# EAGLE design Sunsensors_v1.0 (EAGLE 7.1.0)
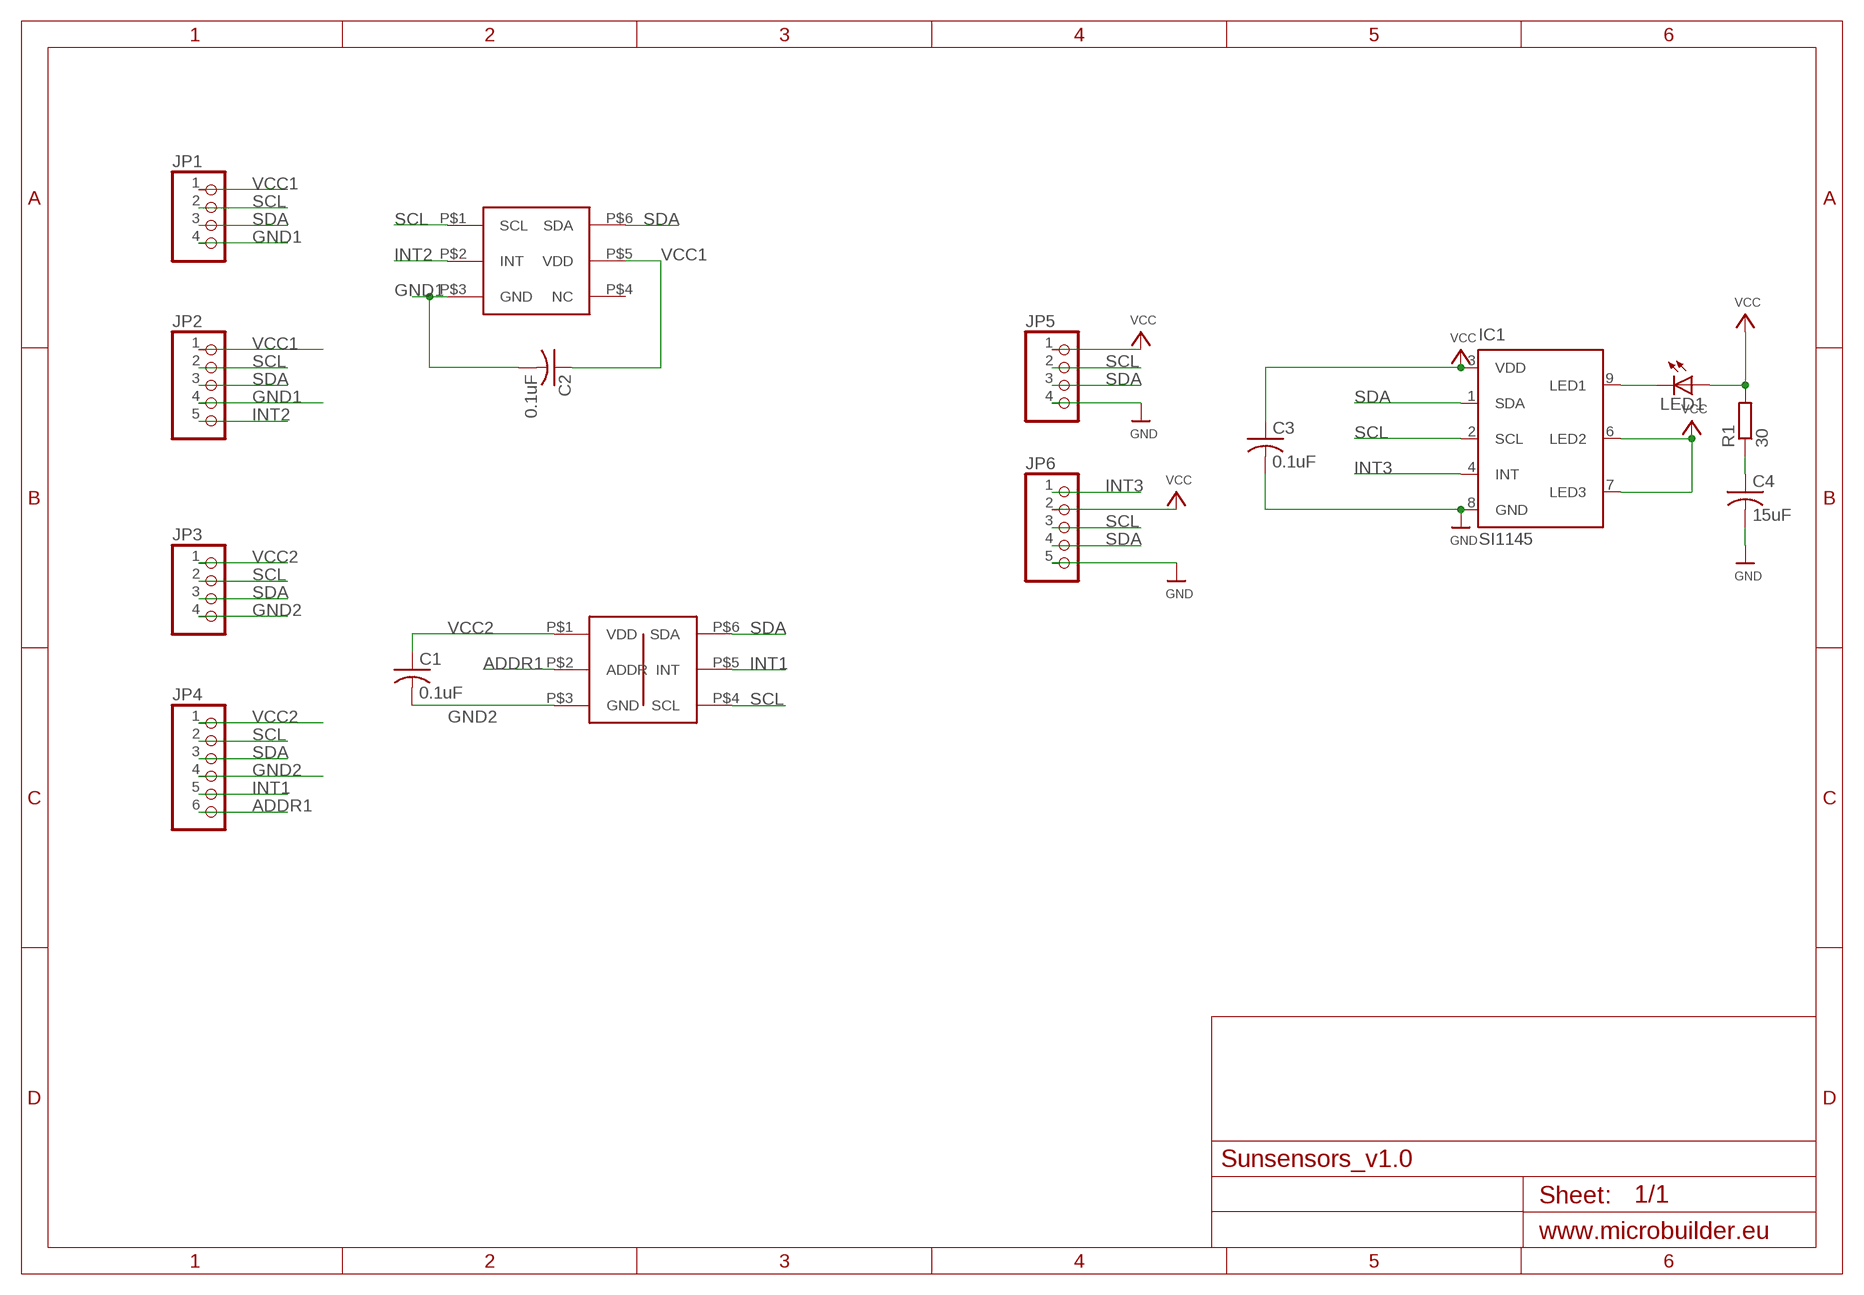
[diagram p0: schematic, sheet 1]

## Parts
C1  0.1uF  C-USC0805  [C0805]
C2  0.1uF  C-USC0805  [C0805]
C3  0.1uF  C-USC0805  [C0805]
C4  15uF  C-USC0805  [C0805]
IC1  SI1145  [QFN-10]
JP1  PINHD-1X4  [1X04]
JP2  PINHD-1X5  [1X05]
JP3  PINHD-1X4  [1X04]
JP4  PINHD-1X6  [1X06]
JP5  PINHD-1X4  [1X04]
JP6  PINHD-1X5  [1X05]
LED1  LEDCHIPLED_0805  [CHIPLED_0805]
R1  30  R-EU_R1206  [R1206]
U$8  TSL25911FN  [ODFN6]
U$9  TSL2561T  [TMB-6]

## Nets
ADDR1: JP4.6 U$9.P$2(ADDR)
GND: C3.2 C4.2 IC1.8(GND) JP5.4 JP6.5
GND1: C2.2 JP1.4 JP2.4 U$8.P$3(GND)
GND2: C1.2 JP3.4 JP4.4 U$9.P$3(GND)
INT1: JP4.5 U$9.P$5(INT)
INT2: JP2.5 U$8.P$2(INT)
INT3: IC1.4(INT) JP6.1
N$1: C4.1 R1.1
N$3: IC1.9(LED1) LED1.C
SCL: IC1.2(SCL) JP1.2 JP2.2 JP3.2 JP4.2 JP5.2 JP6.3 U$8.P$1(SCL) U$9.P$4(SCL)
SDA: IC1.1(SDA) JP1.3 JP2.3 JP3.3 JP4.3 JP5.3 JP6.4 U$8.P$6(SDA) U$9.P$6(SDA)
VCC: C3.1 IC1.3(VDD) IC1.6(LED2) IC1.7(LED3) JP5.1 JP6.2 LED1.A R1.2
VCC1: C2.1 JP1.1 JP2.1 U$8.P$5(VDD)
VCC2: C1.1 JP3.1 JP4.1 U$9.P$1(VDD)
Unconnected: U$8.P$4(NC)

## Library data of the parts
C1-C4 = adafruit:C-US: CAPACITOR, American symbol
IC1 = silabs:SI114*: PROXIMITY/UV/AMBIENT LIGHT SENSOR IC WITH I2C INTERFACE Source: http://www.silabs.com/Support%20Documents/TechnicalDocs/Si1145-46-47.pdf
JP1 JP3 JP5 = pinhead:PINHD-1X4: PIN HEADER
JP2 JP6 = pinhead:PINHD-1X5: PIN HEADER
JP4 = pinhead:PINHD-1X6: PIN HEADER
LED1 = adafruit:LED: LED OSRAM: - CHIPLED LG R971, LG N971, LY N971, LG Q971, LY Q971, LO R971, LY R971 LH N974, LH R974 LS Q976, LO Q976, LY Q976 LO Q996 - Hyper CHIPLED LW Q18S LB Q993, LB Q99A, LB R99A - SideLED LS A670, LO A670, LY A670, LG A670, LP A670 LB A673, LV A673, LT A673, LW A673 LH A674 LY A675 LS A676, LA A676, LO A676, LY A676, LW A676 LS A679, LY A679, LG A679 - Hyper Micro SIDELED® LS Y876, LA Y876, LO Y876, LY Y876 LT Y87S - SmartLED LW L88C, LW L88S LB L89C, LB L89S, LG L890 LS L89K, LO L89K, LY L89K LS L896, LA L896, LO L896, LY L896 - TOPLED LS T670, LO T670, LY T670, LG T670, LP T670 LSG T670, LSP T670, LSY T670, LOP T670, LYG T670 LG T671, LOG T671, LSG T671 LB T673, LV T673, LT T673, LW T673 LH T674 LS T676, LA T676, LO T676, LY T676, LB T676, LH T676, LSB T676, LW T676 LB T67C, LV T67C, LT T67C, LS T67K, LO T67K, LY T67K, LW E67C LS E67B, LA E67B, LO E67B, LY E67B, LB E67C, LV E67C, LT E67C LW T67C LS T679, LY T679, LG T679 LS T770, LO T770, LY T770, LG T770, LP T770 LB T773, LV T773, LT T773, LW T773 LH T774 LS E675, LA E675, LY E675, LS T675 LS T776, LA T776, LO T776, LY T776, LB T776 LHGB T686 LT T68C, LB T68C - Hyper Mini TOPLED® LB M676 - Mini TOPLED Santana® LG M470 LS M47K, LO M47K, LY M47K Source: http://www.osram.convergy.de/
R1 = rcl:R-EU_: RESISTOR, European symbol
U$8 = lpatiny:TSL25911FN: The TSL2591 is a very-high sensitivity light-to-digital converter that transforms light intensity into a digital signal output capable of direct I 2 C interface.
U$9 = lpatiny:TSL2561T: The TSL2560 and TSL2561 are light-to-digital converters that transform light intensity to a digital signal output capable of direct I 2 C (TSL2561) or SMBus (TSL2560) interface.

## Board
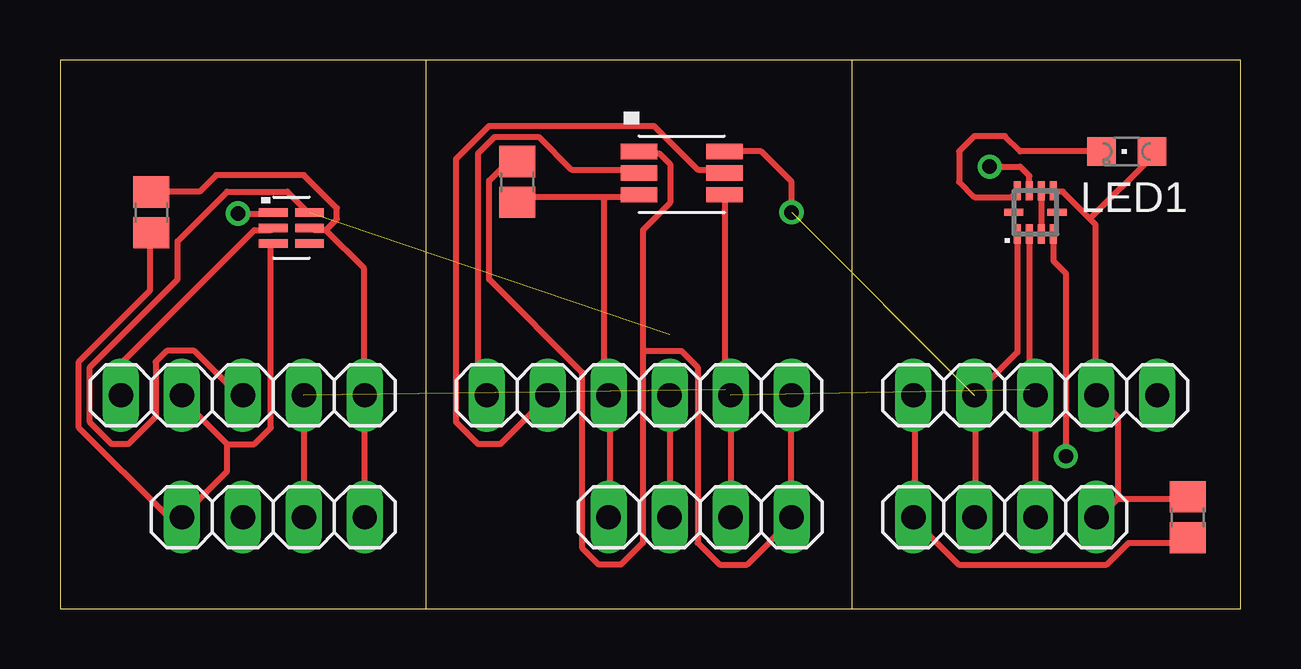
[diagram p1: board, top side]
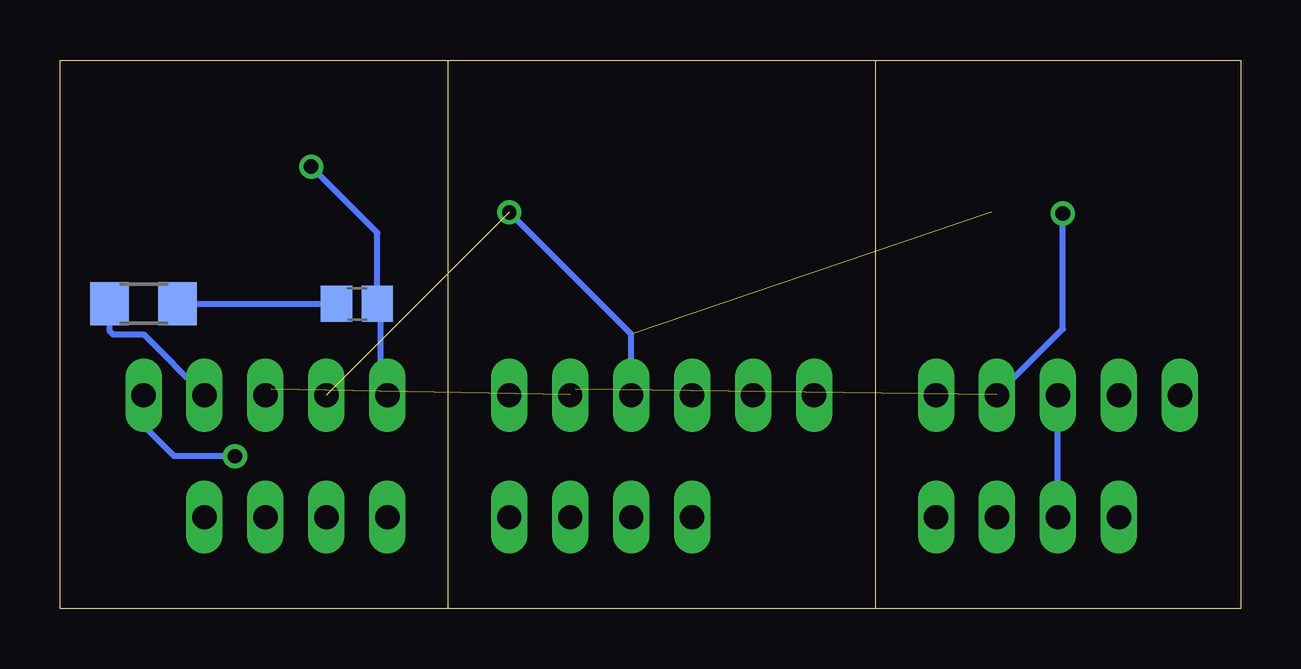
[diagram p2: board, bottom side, seen from below]

Size 49.2 x 22.86 mm. Coordinates in mm from the lower left corner, seen from the top.
Outline: 15.24,0 0,0 0,22.85 49.2,22.85 49.2,0 33.02,0
Outline: 15.24,0 33.02,0
Outline: 15.24,22.86 15.24,0
Outline: 33.02,0 33.02,22.86
Copper layers (1*16): Top 0.035mm / dielectric 1.5mm / Bottom 0.035mm
Design rules "default": minimum track width 10mil, minimum drill 24mil, track to track 8mil, track to pad 8mil, pad to pad 8mil, via to via 8mil, smd to smd 8mil, copper to edge 40mil, drill to drill 8mil, minimum pad ring 10mil, minimum via ring 8mil, stop-mask expansion 4mil, vias tented up to drill 0mil, thermal gap 10mil

### Footprints (pad centres in the part's own frame; a part is rotated, then mirrored left to right if it is on the bottom)
C0805 = smd 1.3 x 1.5: 1 -0.85,0; 2 0.85,0
QFN-10 = smd 0.8 x 0.3: 1 -0.9,0.75; 2 -0.9,0.25; 3 -0.9,-0.25; 4 -0.9,-0.75; 6 0.9,-0.75; 7 0.9,-0.25; 8 0.9,0.25; 9 0.9,0.75 | smd 0.3 x 0.8: 5 0,-0.9; 10 0,0.9
1X04 = drill 1.016 long: 1 -3.81,0; 2 -1.27,0; 3 1.27,0; 4 3.81,0
1X05 = drill 1.016 long: 1 -5.08,0; 2 -2.54,0; 3 0,0; 4 2.54,0; 5 5.08,0
1X06 = drill 1.016 long: 1 -6.35,0; 2 -3.81,0; 3 -1.27,0; 4 1.27,0; 5 3.81,0; 6 6.35,0
CHIPLED_0805 = smd 1.2 x 1.2: A 0,-1.05; C 0,1.05
R1206 = smd 1.6 x 1.803: 1 -1.422,0; 2 1.422,0
ODFN6 = smd 1.199 x 0.351: P$1 0,0; P$2 0,-0.65; P$3 0,-1.3; P$4 1.501,-1.3; P$5 1.501,-0.65; P$6 1.501,0
TMB-6 = smd 1.524 x 0.635: P$1 0,0; P$2 0,-0.899; P$3 0,-1.801; P$4 3.556,-1.801; P$5 3.556,-0.899; P$6 3.556,0

### Placement (x,y rotation side)
C1  19.05,17.78 270 top
C2  3.81,16.51 270 top
C3  46.99,3.81 270 top
C4  36.83,12.7 0 bottom
IC1  40.64,16.51 90 top
JP1  8.89,3.81 180 top
JP2  7.62,8.89 180 top
JP3  26.67,3.81 180 top
JP4  24.13,8.89 180 top
JP5  39.37,3.81 180 top
JP6  40.64,8.89 180 top
LED1  44.45,19.05 90 top
R1  45.72,12.7 180 bottom
U$8  8.89,16.51 0 top
U$9  24.13,19.05 0 top

### Tracks (layer width: path | path; a pad name or v marks a point on that pad's centre or on a via)
ADDR1
  Top 0.254: U$9.P$2 24.05,18.29 21.31,18.29 19.94,19.66 18.11,19.66 17.42,18.97 17.42,9.14 17.65,8.91 JP4.6
GND  (via drill 0.6)
  Top 0.254: C3.2 46.81,2.74 44.53,2.74 43.61,1.83 37.44,1.83 35.61,3.66 JP5.4 35.61,3.89 35.61,8.69 JP6.5 | v38.73,18.41 40,18.41 40.39,18.03 IC1.8
  Bottom 0.254: JP6.5 35.61,8.91 35.84,9.14 35.84,12.57 C4.2 35.98,15.66 v38.73,18.41
GND1
  Top 0.254: 6.96,6.86 8.1,6.86 8.79,7.54 8.79,15.09 U$8.P$3 | 6.96,6.86 5.13,8.69 JP2.4 | C2.2 3.76,15.54 3.76,13.26 0.79,10.29 0.79,7.54 4.45,3.89 4.9,3.89 JP1.4 5.13,3.89 6.96,5.71 6.96,6.86
GND2
  Top 0.254: 22.68,17.14 24.05,17.14 U$9.P$3 | 22.68,17.14 19.25,17.14 C1.2 | JP3.4 22.91,3.89 22.91,8.69 JP4.4 22.68,8.91 22.68,17.14
INT1
  Top 0.254: U$9.P$5 27.48,18.29 26.57,18.29 24.74,20.12 17.88,20.12 16.51,18.75 16.51,7.77 17.42,6.86 18.34,6.86 20.17,8.69 JP4.5
INT2
  Top 0.254: U$8.P$2 8.79,15.77 8.1,15.77 2.62,10.29 2.62,8.91 JP2.5
INT3  (via drill 0.6)
  Top 0.254: IC1.4 41.39,14.49 41.91,13.97 v41.91,6.35
  Bottom 0.254: v41.91,6.35 44.45,6.35 45.72,7.62 JP6.1
N$1
  Bottom 0.254: R1.1 C4.1
N$3
  Top 0.254: LED1.C 40,19.05 39.37,19.68 38.1,19.68 37.46,19.05 37.46,17.78 38.1,17.14 39.62,17.14 IC1.9
SCL  (via drill 0.61)  (2 unrouted)
  Top 0.254: v7.42,16.46 8.79,16.46 U$8.P$1 | JP2.2 JP1.2 | U$9.P$4 27.71,17.14 27.71,9.14 27.94,8.91 JP4.2 JP3.2 | JP5.2 JP6.3 40.39,9.14 IC1.2
  Bottom 0.254: v7.42,16.46 7.42,11.66 10.16,8.91 JP2.2 | 40.64,3.89 JP5.2 | 10.16,3.89 JP1.2 | 27.94,3.89 JP3.2
SDA  (via drill 0.6)  (2 unrouted)
  Top 0.254: U$8.P$6 10.39,16.46 9.47,17.37 6.96,17.37 4.9,15.32 4.9,13.72 1.25,10.06 1.25,7.77 2.16,6.86 2.85,6.86 3.99,8 3.99,10.29 4.45,10.74 5.59,10.74 7.42,8.91 JP2.3 | JP4.3 25.43,8.69 25.43,3.89 JP3.3 | 37.9,3.66 JP5.3 38.12,3.89 38.12,8.69 JP6.4 39.89,10.68 IC1.1 | v30.48,16.51 30.48,17.78 29.21,19.05 U$9.P$6
  Bottom 0.254: JP1.3 7.64,3.89 7.64,8.69 JP2.3 | JP4.3 25.4,11.43 v30.48,16.51
VCC
  Top 0.254: 44.07,4.57 46.81,4.57 C3.1 | 44.07,4.57 43.38,3.89 JP5.1 | 42.91,16.24 43.15,16 43.15,8.91 JP6.2 44.07,8 44.07,4.57 | 42.91,16.24 41.78,17.37 41.33,17.37 IC1.6 IC1.7 IC1.3 | LED1.A 45.5,18.83 42.91,16.24
  Bottom 0.254: R1.2 47.14,11.58 46.99,11.43 45.72,11.43 JP6.2
VCC1
  Top 0.254: 11.07,15.77 10.62,15.77 U$8.P$5 | 11.07,15.77 12.68,14.17 12.68,8.91 JP2.1 12.68,8.69 12.68,3.89 JP1.1 | 11.07,15.77 11.53,16.23 11.53,16.69 10.16,18.06 6.5,18.06 5.82,17.37 3.99,17.37 C2.1
VCC2
  Top 0.254: JP4.1 30.46,8.69 30.46,3.89 JP3.1 30.46,3.66 28.63,1.83 27.48,1.83 26.57,2.74 26.57,10.06 25.88,10.74 24.28,10.74 | 24.28,10.74 24.28,15.77 25.43,16.92 25.43,18.52 24.97,18.97 24.28,18.97 U$9.P$1 | 24.28,10.74 24.28,2.74 23.37,1.83 22.45,1.83 21.77,2.52 21.77,9.83 17.88,13.72 17.88,17.83 18.57,18.52 19.03,18.52 C1.1

### Text on the board
tValues: INT | GND | SDA | SCL | VCC | ADDR | INT | GND | SDA | SCL | VCC | GND | SDA | SCL | VCC | INT